# Altium schematic sheet Extension.SCHDOC: Iris
size A3; Organization: Toradex AG; Address1: Altsagenstrasse 5; Address2: Horw; Address3: 6048; Address4: Switzerland; DocumentNumber: 15; Revision: V2.0; SheetNumber: 15; SheetTotal: 16
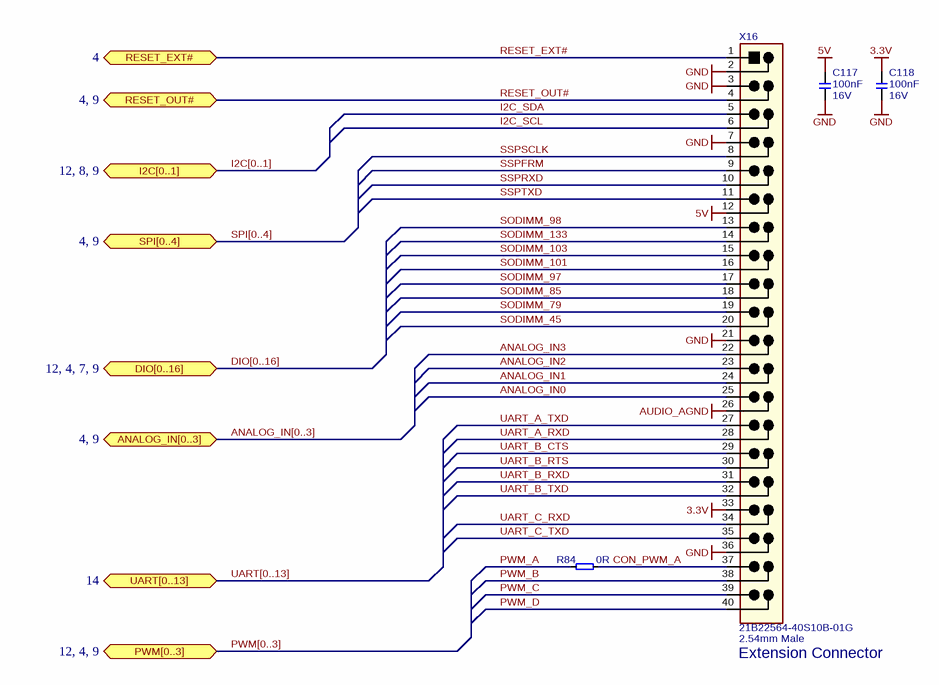
[diagram p0: Extension.SCHDOC]

## Parts
C117  Rating: 16V  [CAPC1005X60N]  (hidden comment: 100nF)
C118  Rating: 16V  [CAPC1005X60N]  (hidden comment: 100nF)
R84  0R  [T_RESC0603X30N]
X16  21B22564-40S10B-01G  [T_JVE_21B22564-40S10B-01G]

## Ports
ANALOG_IN[0..3] (bidir, see 4, 9), DIO[0..16] (bidir, see 12, 4, 7, 9), I2C[0..1] (bidir, see 12, 8, 9), PWM[0..3] (bidir, see 12, 4, 9), RESET_EXT# (bidir, see 4), RESET_OUT# (bidir, see 4, 9), SPI[0..4] (bidir, see 4, 9), UART[0..13] (bidir, see 14)

## Nets
3.3V: C118.2 X16.33
5V: C117.2 X16.12
AUDIO_AGND: X16.26
GND: C117.1 C118.1 X16.2 X16.3 X16.7 X16.21 X16.36
ANALOG_IN0: X16.25
ANALOG_IN1: X16.24
ANALOG_IN2: X16.23
ANALOG_IN3: X16.22
CON_PWM_A: R84.2 X16.37
I2C_SCL: X16.6
I2C_SDA: X16.5
PWM_A: R84.1
PWM_B: X16.38
PWM_C: X16.39
PWM_D: X16.40
RESET_EXT#: X16.1 ; port RESET_EXT#
RESET_OUT#: X16.4 ; port RESET_OUT#
SODIMM_45: X16.20
SODIMM_79: X16.19
SODIMM_85: X16.18
SODIMM_97: X16.17
SODIMM_98: X16.13
SODIMM_101: X16.16
SODIMM_103: X16.15
SODIMM_133: X16.14
SSPFRM: X16.9
SSPRXD: X16.10
SSPSCLK: X16.8
SSPTXD: X16.11
UART_A_RXD: X16.28
UART_A_TXD: X16.27
UART_B_CTS: X16.29
UART_B_RTS: X16.30
UART_B_RXD: X16.31
UART_B_TXD: X16.32
UART_C_RXD: X16.34
UART_C_TXD: X16.35

## Buses and harness runs
bus ANALOG_IN[0..3] = port ANALOG_IN[0..3]
bus DIO[0..16] = port DIO[0..16]
bus I2C[0..1] = port I2C[0..1]
bus PWM[0..3] = port PWM[0..3]
bus SPI[0..4] = port SPI[0..4]
bus UART[0..13] = port UART[0..13]

## Notes on the sheet
- (near X16) Extension Connector
- (near X16) 2.54mm Male
- Title
- Size:
- Date:
- A3
- Number:
- Time:
- Revision:
- Sheet
- of
- File:

## Library data of the parts
C117 C118 = C-X7R-100nF-16V-10%-0402: Capacitor Ceramic X7R 100nF 16V 10% 0402; Tolerance: 10%; Type: X7R; Value: 100nF
R84 = R-0R-63mW-5%-0603: Resistor 0 ohm 63mW 5% 0603; Rating: 63mW; Tolerance: 5%; Value: 0R; Size: 0603 (In)
X16 = CON-JVE-21B22564-40S10B-01G-2X20-2.54mm: 2X20 PIN Header 2.54mm; Manufacturer Name: JVE; No. of ways: 2X20; Manufacturer Part No.: 21B22564-40S10B-01G